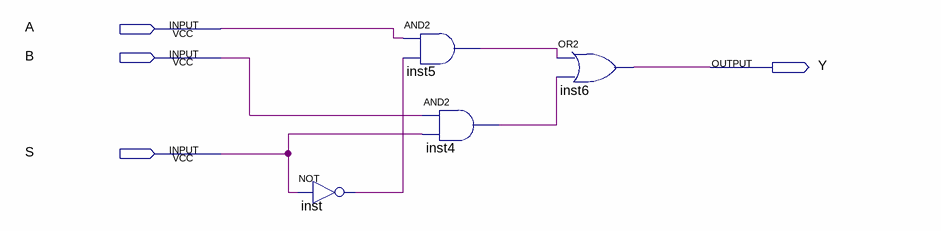
[diagram p0: schematic sheet]
// Quartus schematic Multiplexador_2x1.bdf as structural Verilog: 4 symbols, 4 pins
module Multiplexador_2x1 (
  input  A,
  input  B,
  input  S,
  output Y
);

  wire inst4_out, inst5_out, inst_out;

  not inst (inst_out, S);
  and inst5 (inst5_out, A, inst_out);
  and inst4 (inst4_out, B, S);
  or inst6 (Y, inst5_out, inst4_out);
endmodule
